# Altium schematic sheet 601_GridPos6.SchDoc: Grid Position 6 / USB 5
size A2; Organization: Greenfield Tech Solutions; Address1: Molendreef 33; Address2: Ossendrecht; Address3: 4641CS; Address4: The Netherlands; SheetNumber: 7; SheetTotal: 9
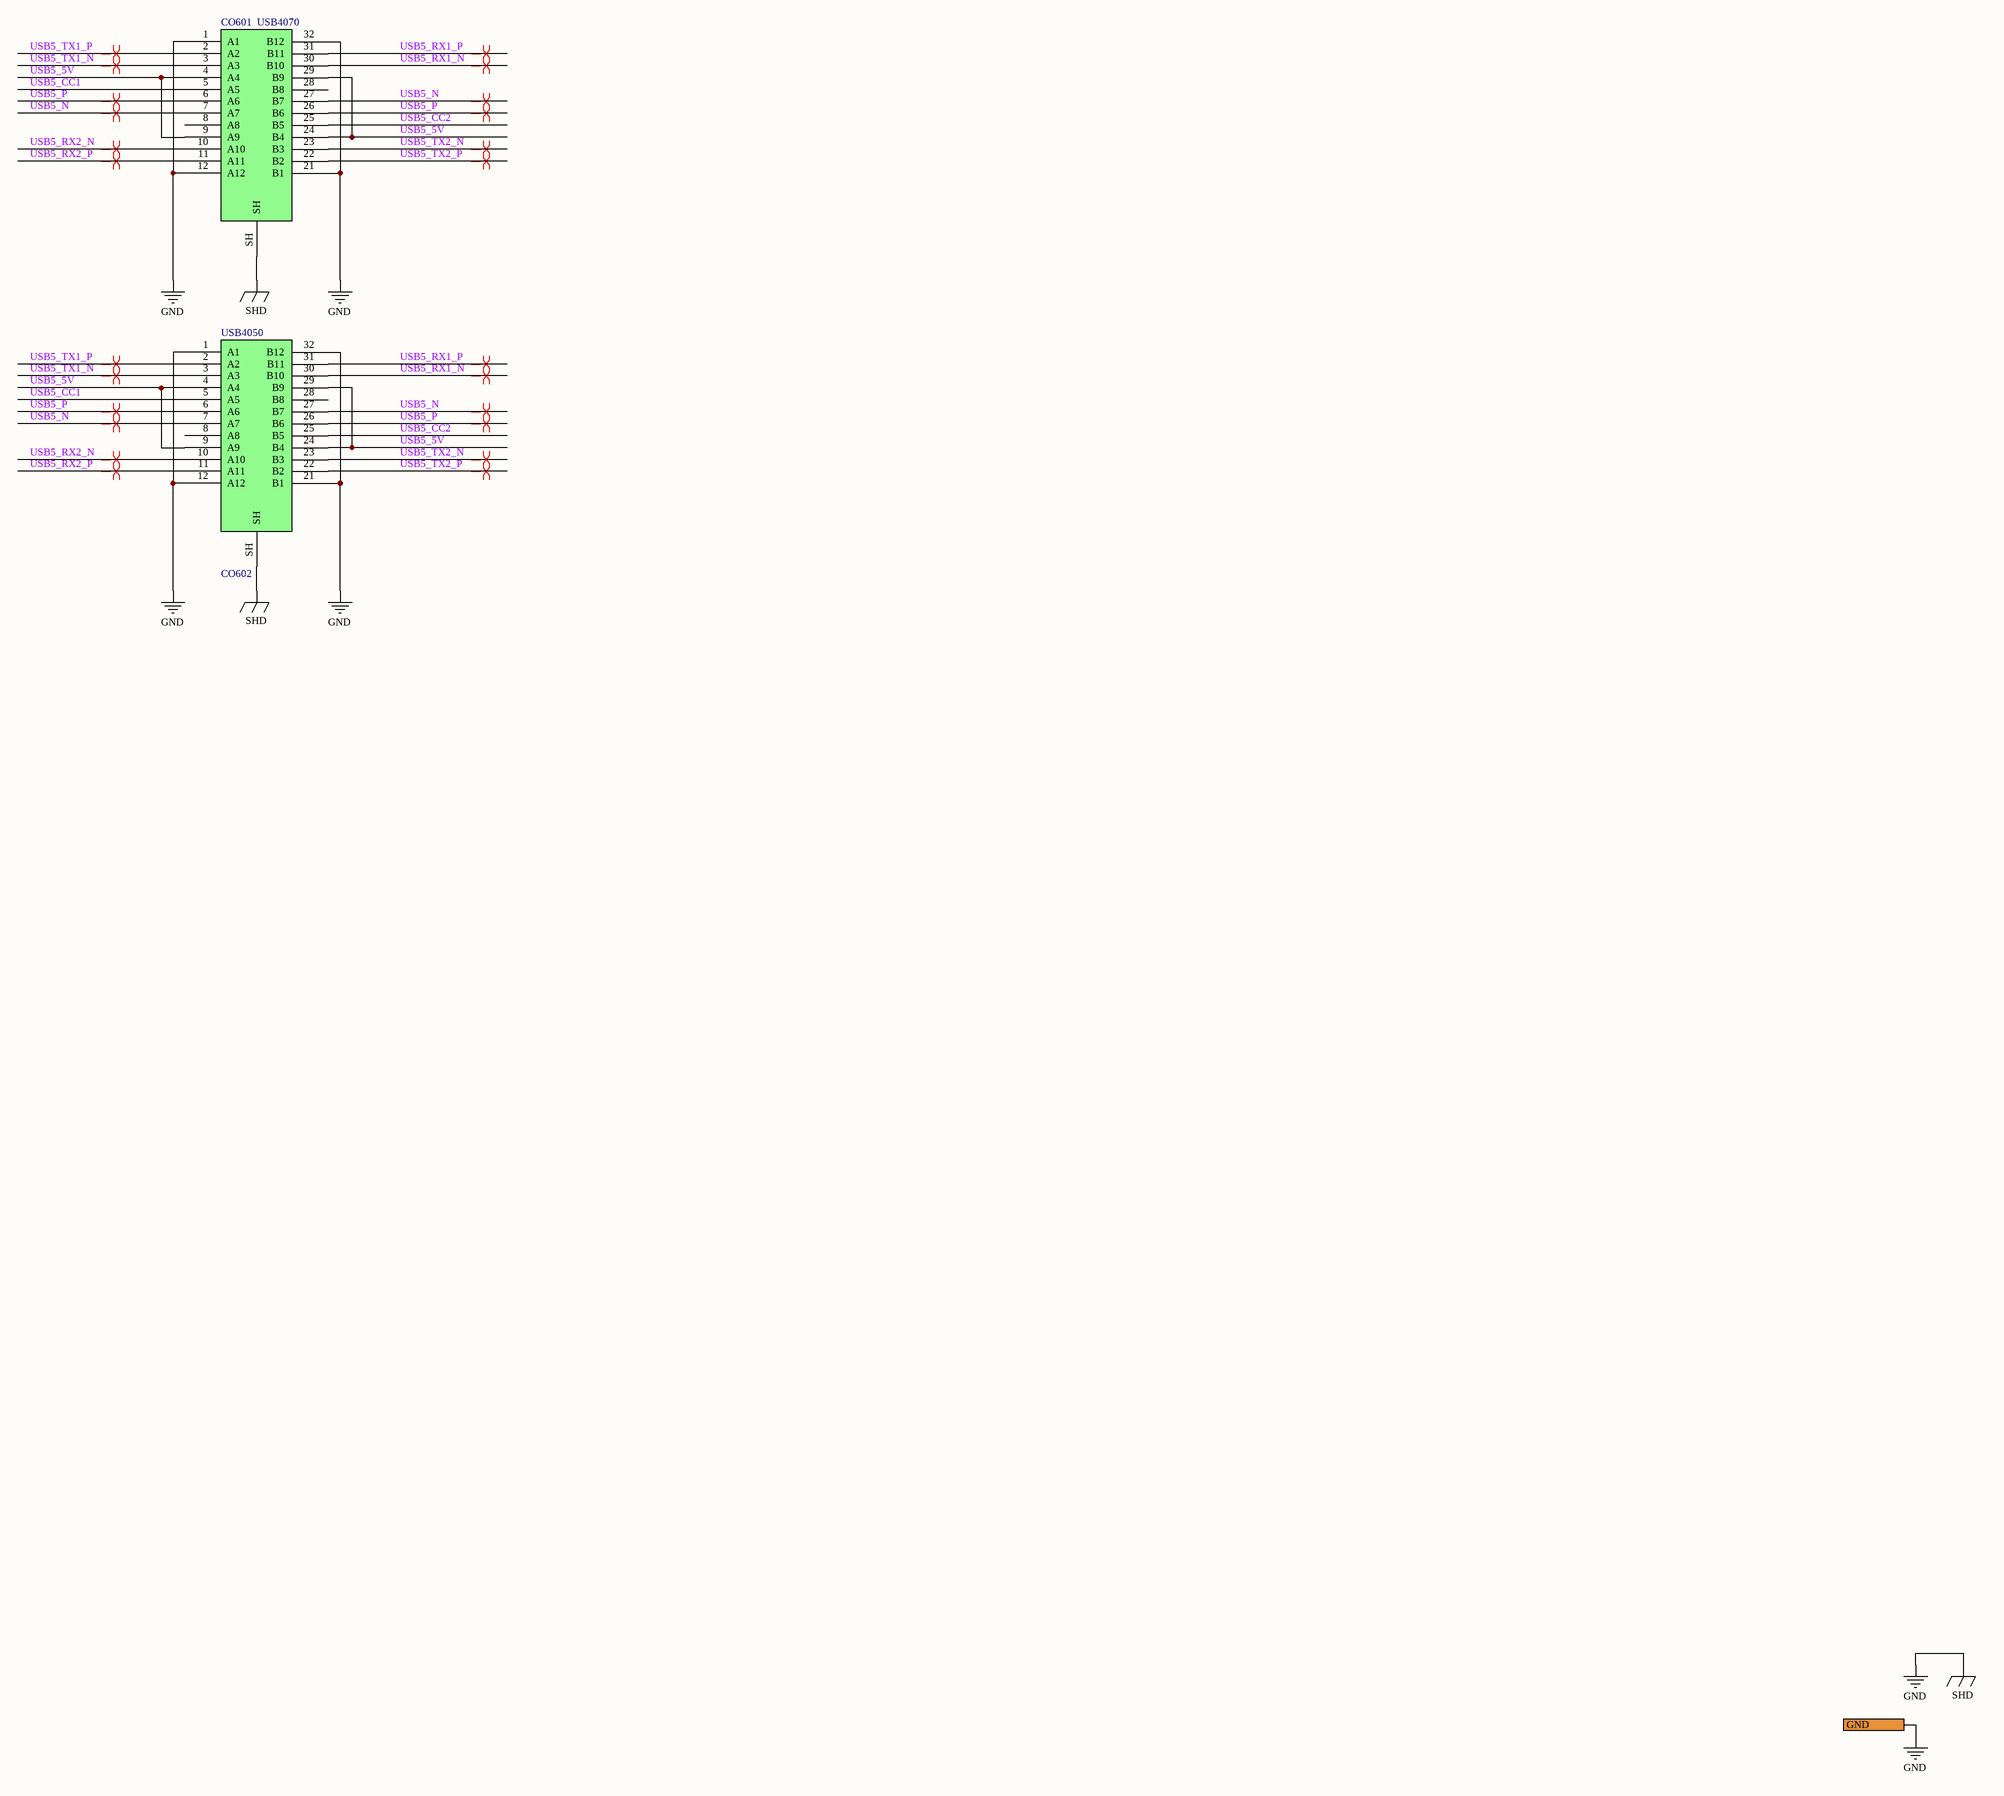
[diagram p0: 601_GridPos6.SchDoc]

## Parts
CO601  USB4070  [USB4070-30-C]
CO602  USB4050  [USB4050-30-A]

## Ports
GND

## Nets
GND: CO601.1(A1) CO601.12(A12) CO601.21(B1) CO601.32(B12) CO601.SH CO602.1(A1) CO602.12(A12) CO602.21(B1) CO602.32(B12) CO602.SH ; port GND  [also labelled SHD]
USB5_5V: CO601.4(A4) CO601.9(A9) CO601.24(B4) CO601.29(B9) CO602.4(A4) CO602.9(A9) CO602.24(B4) CO602.29(B9)
USB5_CC1: CO601.5(A5) CO602.5(A5)
USB5_CC2: CO601.25(B5) CO602.25(B5)
USB5_N: CO601.7(A7) CO601.27(B7) CO602.7(A7) CO602.27(B7)
USB5_P: CO601.6(A6) CO601.26(B6) CO602.6(A6) CO602.26(B6)
USB5_RX1_N: CO601.30(B10) CO602.30(B10)
USB5_RX1_P: CO601.31(B11) CO602.31(B11)
USB5_RX2_N: CO601.10(A10) CO602.10(A10)
USB5_RX2_P: CO601.11(A11) CO602.11(A11)
USB5_TX1_N: CO601.3(A3) CO602.3(A3)
USB5_TX1_P: CO601.2(A2) CO602.2(A2)
USB5_TX2_N: CO601.23(B3) CO602.23(B3)
USB5_TX2_P: CO601.22(B2) CO602.22(B2)

Not connected (* = marked no-connect by the designer): CO601 8(A8) 28(B8); CO602 8(A8) 28(B8)

## Layout directives
differential pair; differential pair class USB3: USB5_N, USB5_P, USB5_RX1_N, USB5_RX1_P, USB5_RX2_N, USB5_RX2_P, USB5_TX1_N, USB5_TX1_P, USB5_TX2_N, USB5_TX2_P

## Notes on the sheet
- Title
- Size:
- Date:
- File:
- A2
- Number:
- Time:
- Revision:
- Sheet
- of

## Library data of the parts
CO601 = CO0021: USB4070-30-C; Part Number: CO0021; ID: 16; RefVal: USB4070; ManfactPart: USB4070-30-C
CO602 = CO0039: USB C connector Receptacle Horizontal; Part Number: CO0039; ID: 39; RefVal: USB4050; ManfactPart: USB4050-30-A